# Altium schematic sheet I2C_GPIOs_MIPI-CSI.SchDoc
size 420 x 297 mm; SheetNumber: 26; SheetTotal: 26
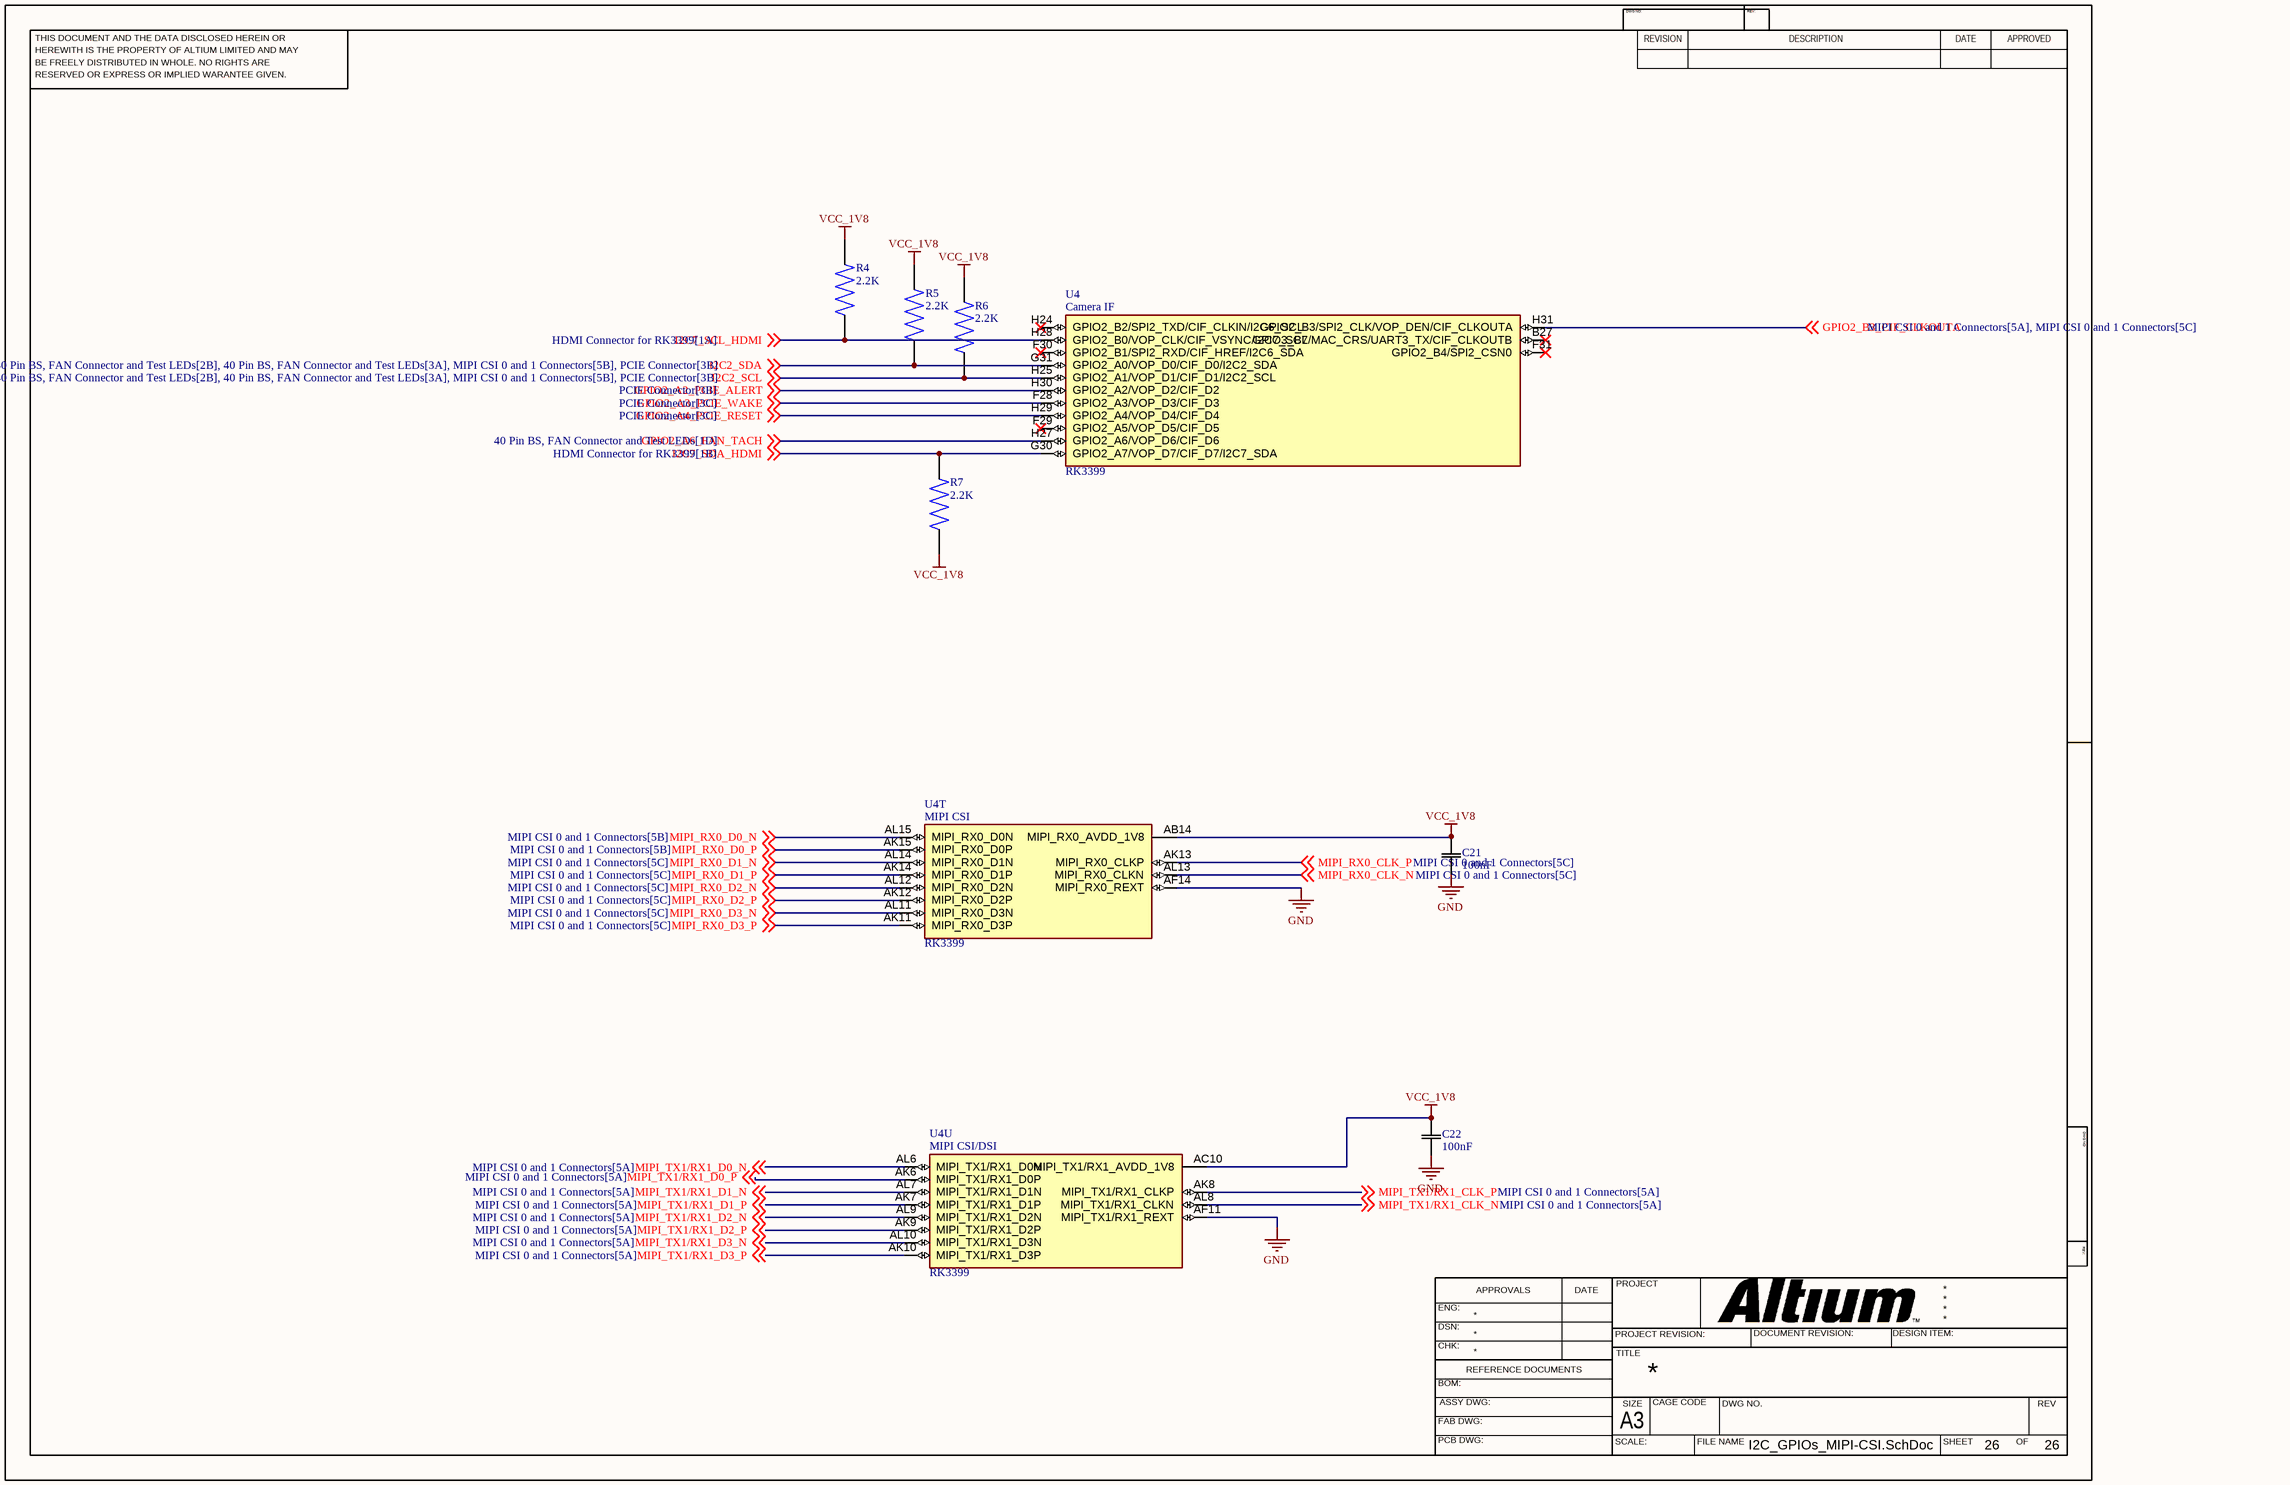
[diagram p0: I2C_GPIOs_MIPI-CSI.SchDoc]

## Parts
C21  100nF  [CAP_1005_TDK]
C22  100nF  [CAP_1005_TDK]
R4  2.2K  [RES_ERA8APB222V]
R5  2.2K  [RES_ERA8APB222V]
R6  2.2K  [RES_ERA8APB222V]
R7  2.2K  [RES_ERA8APB222V]
U4  RK3399  [BGA828C65P31X31_2100X2100X161N]  (parts T,U,28 of 32)

## Nets
GND: C21.1 C22.1 U4.AF11(MIPI_TX1/RX1_REXT) U4.AF14(MIPI_RX0_REXT)
VCC_1V8: C21.2 C22.2 R4.2 R5.2 R6.2 R7.1 U4.AB14(MIPI_RX0_AVDD_1V8) U4.AC10(MIPI_TX1/RX1_AVDD_1V8)
GPIO2_A2_PCIE_ALERT: U4.H30(GPIO2_A2/VOP_D2/CIF_D2) ; off-sheet GPIO2_A2_PCIE_ALERT
GPIO2_A3_PCIE_WAKE: U4.F28(GPIO2_A3/VOP_D3/CIF_D3) ; off-sheet GPIO2_A3_PCIE_WAKE
GPIO2_A4_PCIE_RESET: U4.H29(GPIO2_A4/VOP_D4/CIF_D4) ; off-sheet GPIO2_A4_PCIE_RESET
GPIO2_A6_FAN_TACH: U4.H27(GPIO2_A6/VOP_D6/CIF_D6) ; off-sheet GPIO2_A6_FAN_TACH
GPIO2_B3_CIF_CLKOUTA: U4.H31(GPIO2_B3/SPI2_CLK/VOP_DEN/CIF_CLKOUTA) ; off-sheet GPIO2_B3_CIF_CLKOUTA
I2C2_SCL: R6.1 U4.H25(GPIO2_A1/VOP_D1/CIF_D1/I2C2_SCL) ; off-sheet I2C2_SCL
I2C2_SDA: R5.1 U4.G31(GPIO2_A0/VOP_D0/CIF_D0/I2C2_SDA) ; off-sheet I2C2_SDA
I2C7_SCL_HDMI: R4.1 U4.H28(GPIO2_B0/VOP_CLK/CIF_VSYNC/I2C7_SCL) ; off-sheet I2C7_SCL_HDMI
I2C7_SDA_HDMI: R7.2 U4.G30(GPIO2_A7/VOP_D7/CIF_D7/I2C7_SDA) ; off-sheet I2C7_SDA_HDMI
MIPI_RX0_CLK_N: U4.AL13(MIPI_RX0_CLKN) ; off-sheet MIPI_RX0_CLK_N
MIPI_RX0_CLK_P: U4.AK13(MIPI_RX0_CLKP) ; off-sheet MIPI_RX0_CLK_P
MIPI_RX0_D0_N: U4.AL15(MIPI_RX0_D0N) ; off-sheet MIPI_RX0_D0_N
MIPI_RX0_D0_P: U4.AK15(MIPI_RX0_D0P) ; off-sheet MIPI_RX0_D0_P
MIPI_RX0_D1_N: U4.AL14(MIPI_RX0_D1N) ; off-sheet MIPI_RX0_D1_N
MIPI_RX0_D1_P: U4.AK14(MIPI_RX0_D1P) ; off-sheet MIPI_RX0_D1_P
MIPI_RX0_D2_N: U4.AL12(MIPI_RX0_D2N) ; off-sheet MIPI_RX0_D2_N
MIPI_RX0_D2_P: U4.AK12(MIPI_RX0_D2P) ; off-sheet MIPI_RX0_D2_P
MIPI_RX0_D3_N: U4.AL11(MIPI_RX0_D3N) ; off-sheet MIPI_RX0_D3_N
MIPI_RX0_D3_P: U4.AK11(MIPI_RX0_D3P) ; off-sheet MIPI_RX0_D3_P
MIPI_TX1/RX1_CLK_N: U4.AL8(MIPI_TX1/RX1_CLKN) ; off-sheet MIPI_TX1/RX1_CLK_N
MIPI_TX1/RX1_CLK_P: U4.AK8(MIPI_TX1/RX1_CLKP) ; off-sheet MIPI_TX1/RX1_CLK_P
MIPI_TX1/RX1_D0_N: U4.AL6(MIPI_TX1/RX1_D0N) ; off-sheet MIPI_TX1/RX1_D0_N
MIPI_TX1/RX1_D0_P: U4.AK6(MIPI_TX1/RX1_D0P) ; off-sheet MIPI_TX1/RX1_D0_P
MIPI_TX1/RX1_D1_N: U4.AL7(MIPI_TX1/RX1_D1N) ; off-sheet MIPI_TX1/RX1_D1_N
MIPI_TX1/RX1_D1_P: U4.AK7(MIPI_TX1/RX1_D1P) ; off-sheet MIPI_TX1/RX1_D1_P
MIPI_TX1/RX1_D2_N: U4.AL9(MIPI_TX1/RX1_D2N) ; off-sheet MIPI_TX1/RX1_D2_N
MIPI_TX1/RX1_D2_P: U4.AK9(MIPI_TX1/RX1_D2P) ; off-sheet MIPI_TX1/RX1_D2_P
MIPI_TX1/RX1_D3_N: U4.AL10(MIPI_TX1/RX1_D3N) ; off-sheet MIPI_TX1/RX1_D3_N
MIPI_TX1/RX1_D3_P: U4.AK10(MIPI_TX1/RX1_D3P) ; off-sheet MIPI_TX1/RX1_D3_P

Not connected (* = marked no-connect by the designer): U4 B27(GPIO3_B7/MAC_CRS/UART3_TX/CIF_CLKOUTB)* F29(GPIO2_A5/VOP_D5/CIF_D5)* F30(GPIO2_B1/SPI2_RXD/CIF_HREF/I2C6_SDA)* F31(GPIO2_B4/SPI2_CSN0)* H24(GPIO2_B2/SPI2_TXD/CIF_CLKIN/I2C6_SCL)*

## Notes on the sheet
- THIS DOCUMENT AND THE DATA DISCLOSED HEREIN OR
- HEREWITH IS THE PROPERTY OF ALTIUM LIMITED AND MAY
- DWG NO:
- REVISION
- REV:
- DESCRIPTION
- DATE
- APPROVED
- BE FREELY DISTRIBUTED IN WHOLE. NO RIGHTS ARE
- RESERVED OR EXPRESS OR IMPLIED WARANTEE GIVEN.
- ENG:
- APPROVALS
- PROJECT
- DSN:
- CHK:
- REFERENCE DOCUMENTS
- PROJECT REVISION:
- TITLE
- DOCUMENT REVISION:
- DESIGN ITEM:
- BOM:
- FAB DWG:
- PCB DWG:
- ASSY DWG:
- SCALE:
- A3
- SIZE
- CAGE CODE
- FILE NAME
- DWG NO.
- SHEET
- OF
- REV
- (in symbol RK3399, part T) MIPI CSI
- (in symbol RK3399, part U) MIPI CSI/DSI
- (in symbol RK3399, part 28) Camera IF

## Library data of the parts
C21 C22 = C1005X7R1H104M050BB: Description; Manufacturer_Name: TDK; Copyright: Copyright (C) 2025 Ultra Librarian. All rights reserved.; Manufacturer_Part_Number: C1005X7R1H104M050BB
R4-R7 = ERA8APB222V: Availability: Unavailable; Price: None; Package: None; MP: ERA8APB222V; Value: *
U4 = RK3399: RK3399 ROCK Pi 4 Model A 2GB - ARMÂ® CortexÂ®-A53, CortexÂ®-A72 MPU Embedded Evaluation Board; MF: Rockchip; SnapEDA_Link: https://www.snapeda.com/parts/RK3399/Fuzhou+Rockchip+Electronics+Co/view-part/?ref=snap; Package: Seeed Technology; MP: RK3399; Check_prices: https://www.snapeda.com/parts/RK3399/Fuzhou+Rockchip+Electronics+Co/view-part/?ref=eda; Price: None; Value: *; Availability: Not in stock